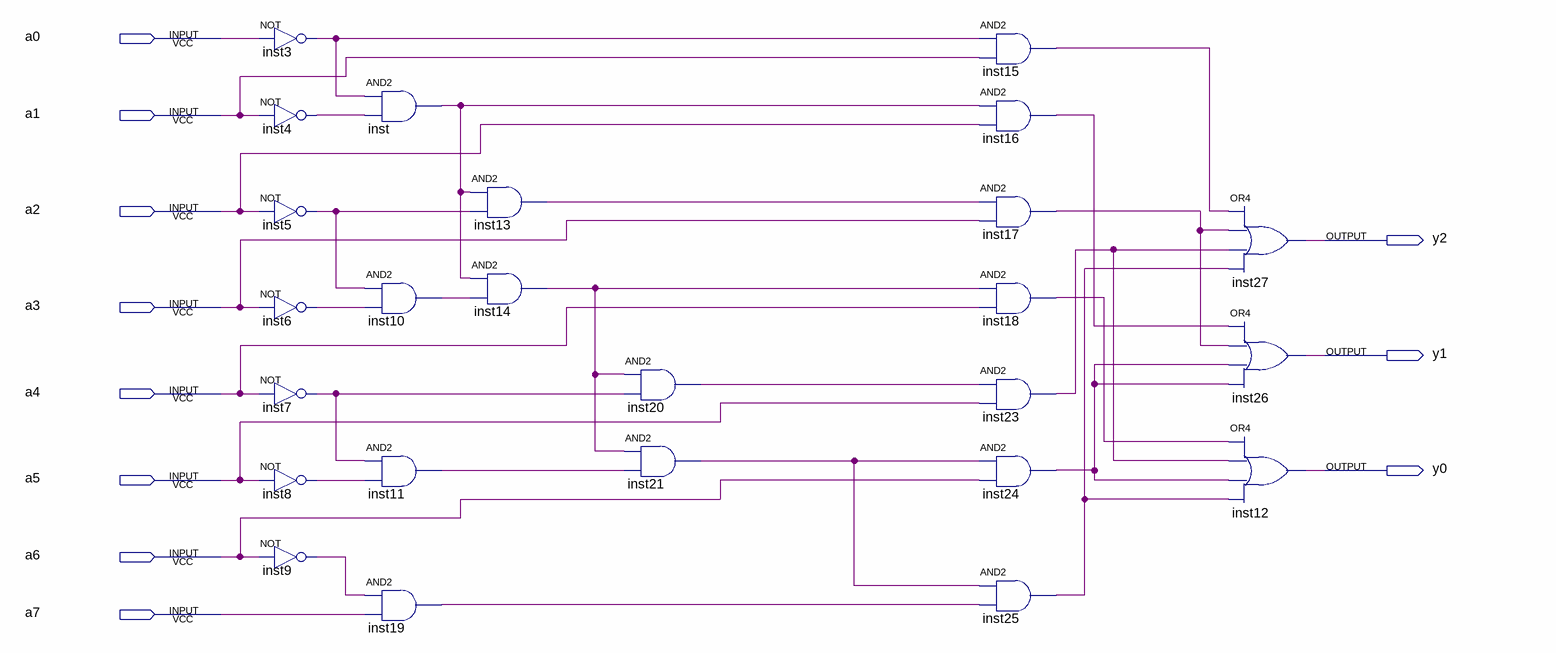
[diagram p0: schematic sheet]
// Quartus schematic priorityCoder.bdf as structural Verilog: 25 symbols, 11 pins
module priorityCoder (
  input  a0,
  input  a1,
  input  a2,
  input  a3,
  input  a4,
  input  a5,
  input  a6,
  input  a7,
  output y2,
  output y1,
  output y0
);

  wire inst3_out, inst4_out, inst5_out, inst6_out, inst7_out, inst8_out, inst9_out, inst10_out, inst11_out,
       inst13_out, inst14_out, inst15_out, inst16_out, inst17_out, inst18_out, inst19_out, inst20_out,
       inst21_out, inst23_out, inst24_out, inst25_out, inst_out;

  not inst3 (inst3_out, a0);
  not inst4 (inst4_out, a1);
  not inst5 (inst5_out, a2);
  not inst6 (inst6_out, a3);
  not inst7 (inst7_out, a4);
  not inst8 (inst8_out, a5);
  not inst9 (inst9_out, a6);
  and inst (inst_out, inst3_out, inst4_out);
  and inst10 (inst10_out, inst5_out, inst6_out);
  and inst11 (inst11_out, inst7_out, inst8_out);
  and inst19 (inst19_out, inst9_out, a7);
  and inst13 (inst13_out, inst_out, inst5_out);
  and inst14 (inst14_out, inst_out, inst10_out);
  and inst20 (inst20_out, inst14_out, inst7_out);
  and inst21 (inst21_out, inst14_out, inst11_out);
  and inst15 (inst15_out, inst3_out, a1);
  and inst16 (inst16_out, inst_out, a2);
  and inst17 (inst17_out, inst13_out, a3);
  and inst18 (inst18_out, inst14_out, a4);
  and inst23 (inst23_out, inst20_out, a5);
  and inst24 (inst24_out, inst21_out, a6);
  and inst25 (inst25_out, inst21_out, inst19_out);
  or inst27 (y2, inst15_out, inst17_out, inst23_out, inst25_out);
  or inst26 (y1, inst16_out, inst17_out, inst24_out, inst24_out);
  or inst12 (y0, inst18_out, inst23_out, inst24_out, inst25_out);
endmodule
